# EAGLE schematic rel-prog-counter (EAGLE 9.6.2)
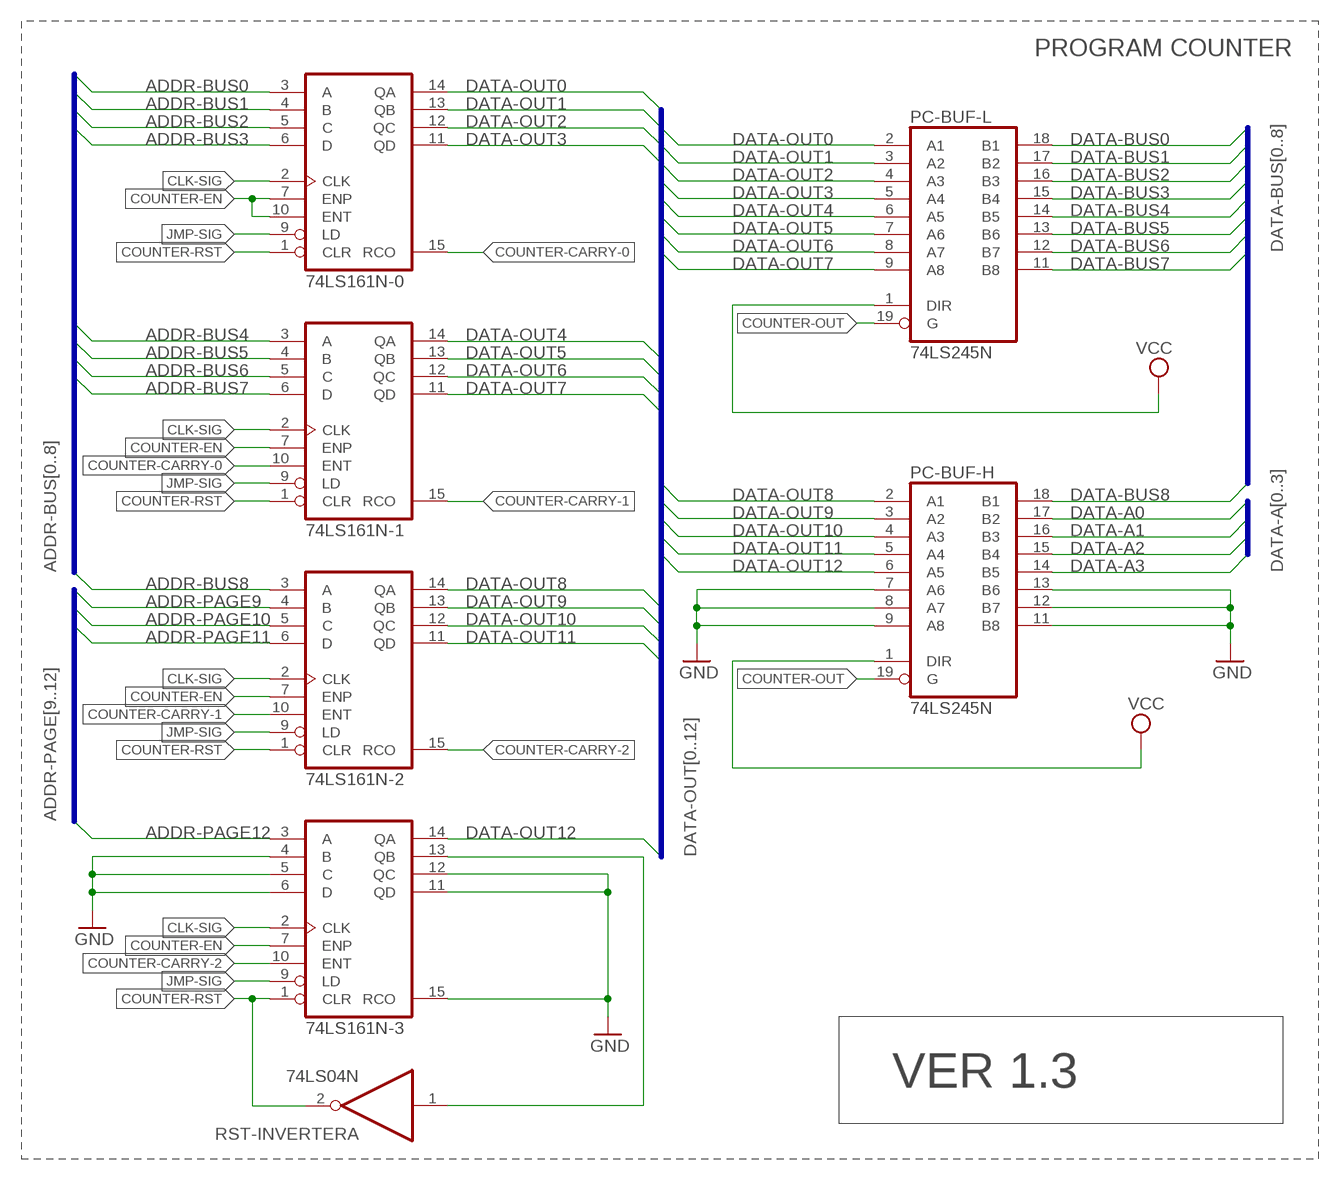
[diagram p0: schematic, sheet 1]

## Parts
74LS161N-0  74160N  [DIL16]
74LS161N-1  74160N  [DIL16]
74LS161N-2  74160N  [DIL16]
74LS161N-3  74160N  [DIL16]
PC-BUF-H  74LS245N  [DIL20]
PC-BUF-L  74LS245N  [DIL20]
RST-INVERTER  74LS04N  [DIL14]

## Nets
ADDR-BUS0: 74LS161N-0.3(A)
ADDR-BUS1: 74LS161N-0.4(B)
ADDR-BUS2: 74LS161N-0.5(C)
ADDR-BUS3: 74LS161N-0.6(D)
ADDR-BUS4: 74LS161N-1.3(A)
ADDR-BUS5: 74LS161N-1.4(B)
ADDR-BUS6: 74LS161N-1.5(C)
ADDR-BUS7: 74LS161N-1.6(D)
ADDR-BUS8: 74LS161N-2.3(A)
ADDR-PAGE9: 74LS161N-2.4(B)
ADDR-PAGE10: 74LS161N-2.5(C)
ADDR-PAGE11: 74LS161N-2.6(D)
ADDR-PAGE12: 74LS161N-3.3(A)
CLK-SIG: 74LS161N-0.2(CLK) 74LS161N-1.2(CLK) 74LS161N-2.2(CLK) 74LS161N-3.2(CLK)
COUNTER-CARRY-0: 74LS161N-0.15(RCO) 74LS161N-1.10(ENT)
COUNTER-CARRY-1: 74LS161N-1.15(RCO) 74LS161N-2.10(ENT)
COUNTER-CARRY-2: 74LS161N-2.15(RCO) 74LS161N-3.10(ENT)
COUNTER-EN: 74LS161N-0.7(ENP) 74LS161N-0.10(ENT) 74LS161N-1.7(ENP) 74LS161N-2.7(ENP) 74LS161N-3.7(ENP)
COUNTER-OUT: PC-BUF-H.19(G) PC-BUF-L.19(G)
COUNTER-RST: 74LS161N-0.1(CLR) 74LS161N-1.1(CLR) 74LS161N-2.1(CLR) 74LS161N-3.1(CLR) RST-INVERTER.2(A:O)
DATA-A0: PC-BUF-H.17(B2)
DATA-A1: PC-BUF-H.16(B3)
DATA-A2: PC-BUF-H.15(B4)
DATA-A3: PC-BUF-H.14(B5)
DATA-BUS0: PC-BUF-L.18(B1)
DATA-BUS1: PC-BUF-L.17(B2)
DATA-BUS2: PC-BUF-L.16(B3)
DATA-BUS3: PC-BUF-L.15(B4)
DATA-BUS4: PC-BUF-L.14(B5)
DATA-BUS5: PC-BUF-L.13(B6)
DATA-BUS6: PC-BUF-L.12(B7)
DATA-BUS7: PC-BUF-L.11(B8)
DATA-BUS8: PC-BUF-H.18(B1)
DATA-OUT0: 74LS161N-0.14(QA) PC-BUF-L.2(A1)
DATA-OUT1: 74LS161N-0.13(QB) PC-BUF-L.3(A2)
DATA-OUT2: 74LS161N-0.12(QC) PC-BUF-L.4(A3)
DATA-OUT3: 74LS161N-0.11(QD) PC-BUF-L.5(A4)
DATA-OUT4: 74LS161N-1.14(QA) PC-BUF-L.6(A5)
DATA-OUT5: 74LS161N-1.13(QB) PC-BUF-L.7(A6)
DATA-OUT6: 74LS161N-1.12(QC) PC-BUF-L.8(A7)
DATA-OUT7: 74LS161N-1.11(QD) PC-BUF-L.9(A8)
DATA-OUT8: 74LS161N-2.14(QA) PC-BUF-H.2(A1)
DATA-OUT9: 74LS161N-2.13(QB) PC-BUF-H.3(A2)
DATA-OUT10: 74LS161N-2.12(QC) PC-BUF-H.4(A3)
DATA-OUT11: 74LS161N-2.11(QD) PC-BUF-H.5(A4)
DATA-OUT12: 74LS161N-3.14(QA) PC-BUF-H.6(A5)
GND: 74LS161N-3.4(B) 74LS161N-3.5(C) 74LS161N-3.6(D) 74LS161N-3.11(QD) 74LS161N-3.12(QC) 74LS161N-3.15(RCO) PC-BUF-H.7(A6) PC-BUF-H.8(A7) PC-BUF-H.9(A8) PC-BUF-H.11(B8) PC-BUF-H.12(B7) PC-BUF-H.13(B6)
JMP-SIG: 74LS161N-0.9(LD) 74LS161N-1.9(LD) 74LS161N-2.9(LD) 74LS161N-3.9(LD)
N$1: 74LS161N-3.13(QB) RST-INVERTER.1(A:I)
VCC: PC-BUF-H.1(DIR) PC-BUF-L.1(DIR)
Unconnected: RST-INVERTER.3(B:I) RST-INVERTER.4(B:O) RST-INVERTER.5(C:I) RST-INVERTER.6(C:O) RST-INVERTER.8(D:O) RST-INVERTER.9(D:I) RST-INVERTER.10(E:O) RST-INVERTER.11(E:I) RST-INVERTER.12(F:O) RST-INVERTER.13(F:I)

## Buses
DATA-OUT[0..12]
ADDR-BUS[0..8]
ADDR-PAGE[9..12]
DATA-BUS[0..8]
DATA-A[0..3]

## Notes on the sheet
- PROGRAM COUNTER
- VER 1.3

## Power pins joined to a net without a drawn wire
GND: 74LS161N-0.8(GND) 74LS161N-1.8(GND) 74LS161N-2.8(GND) 74LS161N-3.8(GND) PC-BUF-H.10(GND) PC-BUF-L.10(GND) RST-INVERTER.7(P:GND)
VCC: 74LS161N-0.16(VCC) 74LS161N-1.16(VCC) 74LS161N-2.16(VCC) 74LS161N-3.16(VCC) PC-BUF-H.20(VCC) PC-BUF-L.20(VCC) RST-INVERTER.14(P:VCC)

## Library data of the parts
74LS161N-0 74LS161N-1-74LS161N-3 = 74xx-eu:74*160: Synchronous 4-bit COUNTER
PC-BUF-H PC-BUF-L = 74xx-eu:74*245: Octal BUS TRANSCEIVER, 3-state
RST-INVERTER = 74xx-eu:74*04: Hex INVERTER